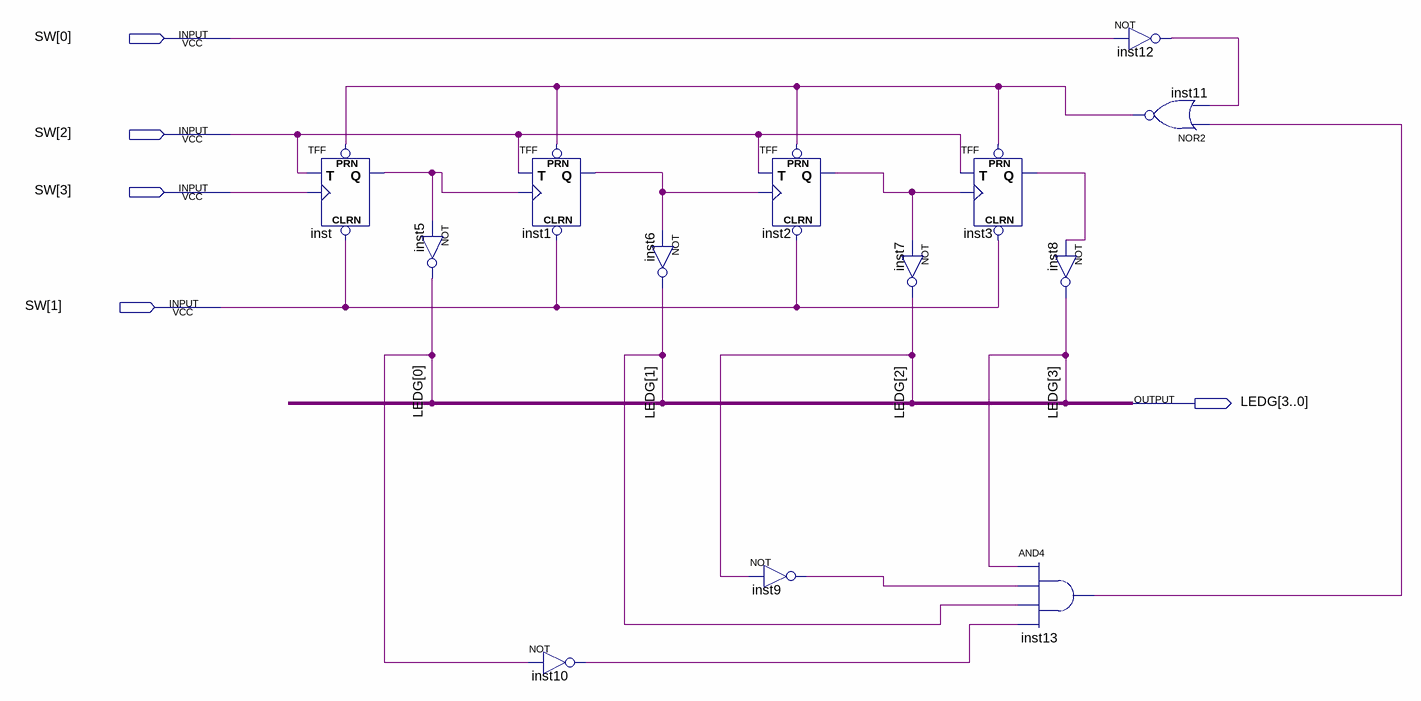
[diagram p0: schematic sheet]
// Quartus schematic compteurModule10.bdf as structural Verilog: 13 symbols, 5 pins
module compteurModule10 (
  input  [3:0] SW,
  output [3:0] LEDG
);

  wire inst1_q, inst2_q, inst3_q, inst9_out, inst10_out, inst11_out, inst12_out, inst13_out, inst_q;

  TFF inst (.PRN(inst11_out), .CLRN(SW[1]), .T(SW[2]), .CLK(SW[3]), .Q(inst_q));
  not inst5 (LEDG[0], inst_q);
  TFF inst1 (.PRN(inst11_out), .CLRN(SW[1]), .T(SW[2]), .CLK(inst_q), .Q(inst1_q));
  not inst10 (inst10_out, LEDG[0]);
  not inst6 (LEDG[1], inst1_q);
  TFF inst2 (.PRN(inst11_out), .CLRN(SW[1]), .T(SW[2]), .CLK(inst1_q), .Q(inst2_q));
  not inst9 (inst9_out, LEDG[2]);
  not inst7 (LEDG[2], inst2_q);
  TFF inst3 (.PRN(inst11_out), .CLRN(SW[1]), .T(SW[2]), .CLK(inst2_q), .Q(inst3_q));
  and inst13 (inst13_out, LEDG[3], inst9_out, LEDG[1], inst10_out);
  not inst8 (LEDG[3], inst3_q);
  not inst12 (inst12_out, SW[0]);
  nor inst11 (inst11_out, inst13_out, inst12_out);
endmodule
